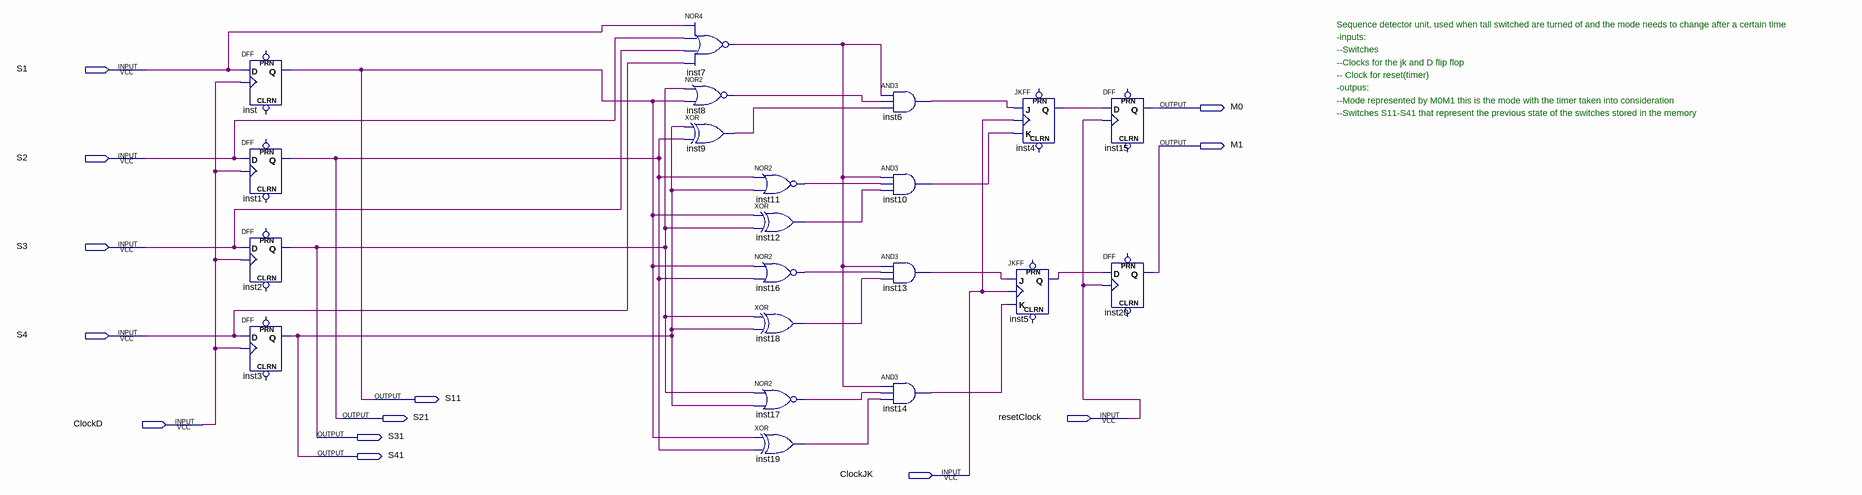
[diagram p0: schematic sheet]
// Quartus schematic SequenceDetector.bdf as structural Verilog: 21 symbols, 13 pins
module SequenceDetector (
  input  S1,
  input  S2,
  input  S3,
  input  S4,
  input  resetClock,
  input  ClockD,
  input  ClockJK,
  output M0,
  output M1,
  output S11,
  output S21,
  output S31,
  output S41
);

  wire inst4_q, inst5_q, inst6_out, inst7_out, inst8_out, inst9_out, inst10_out, inst11_out, inst12_out,
       inst13_out, inst14_out, inst16_out, inst17_out, inst18_out, inst19_out;

  DFF inst (.CLK(ClockD), .D(S1), .Q(S11));  // open: CLRN, PRN
  DFF inst1 (.CLK(ClockD), .D(S2), .Q(S21));  // open: CLRN, PRN
  DFF inst2 (.CLK(ClockD), .D(S3), .Q(S31));  // open: CLRN, PRN
  DFF inst3 (.CLK(ClockD), .D(S4), .Q(S41));  // open: CLRN, PRN
  nor inst7 (inst7_out, S1, S2, S3, S4);
  nor inst8 (inst8_out, S31, S11);
  xor inst9 (inst9_out, S41, S21);
  nor inst11 (inst11_out, S21, S41);
  xor inst12 (inst12_out, S11, S31);
  nor inst16 (inst16_out, S11, S21);
  xor inst18 (inst18_out, S31, S41);
  nor inst17 (inst17_out, S31, S41);
  xor inst19 (inst19_out, S11, S21);
  and inst6 (inst6_out, inst7_out, inst8_out, inst9_out);
  and inst10 (inst10_out, inst7_out, inst11_out, inst12_out);
  and inst13 (inst13_out, inst7_out, inst16_out, inst18_out);
  and inst14 (inst14_out, inst7_out, inst17_out, inst19_out);
  JKFF inst5 (.K(inst14_out), .J(inst13_out), .CLK(ClockJK), .Q(inst5_q));  // open: PRN, CLRN
  JKFF inst4 (.K(inst10_out), .J(inst6_out), .CLK(ClockJK), .Q(inst4_q));  // open: PRN, CLRN
  DFF inst15 (.CLK(resetClock), .D(inst4_q), .Q(M0));  // open: CLRN, PRN
  DFF inst20 (.CLK(resetClock), .D(inst5_q), .Q(M1));  // open: CLRN, PRN

  // Notes on the sheet:
  //   Sequence detector unit, used when tall switched are turned of and the mode needs to change after a certain time
  //   -inputs:
  //   --Switches
  //   --Clocks for the jk and D flip flop
  //   -- Clock for reset(timer)
  //   -outpus:
  //   --Mode represented by M0M1 this is the mode with the timer taken into consideration
  //   --Switches S11-S41 that represent the previous state of the switches stored in the memory
endmodule
